# EAGLE design adc_cap (EAGLE 7.1.0)
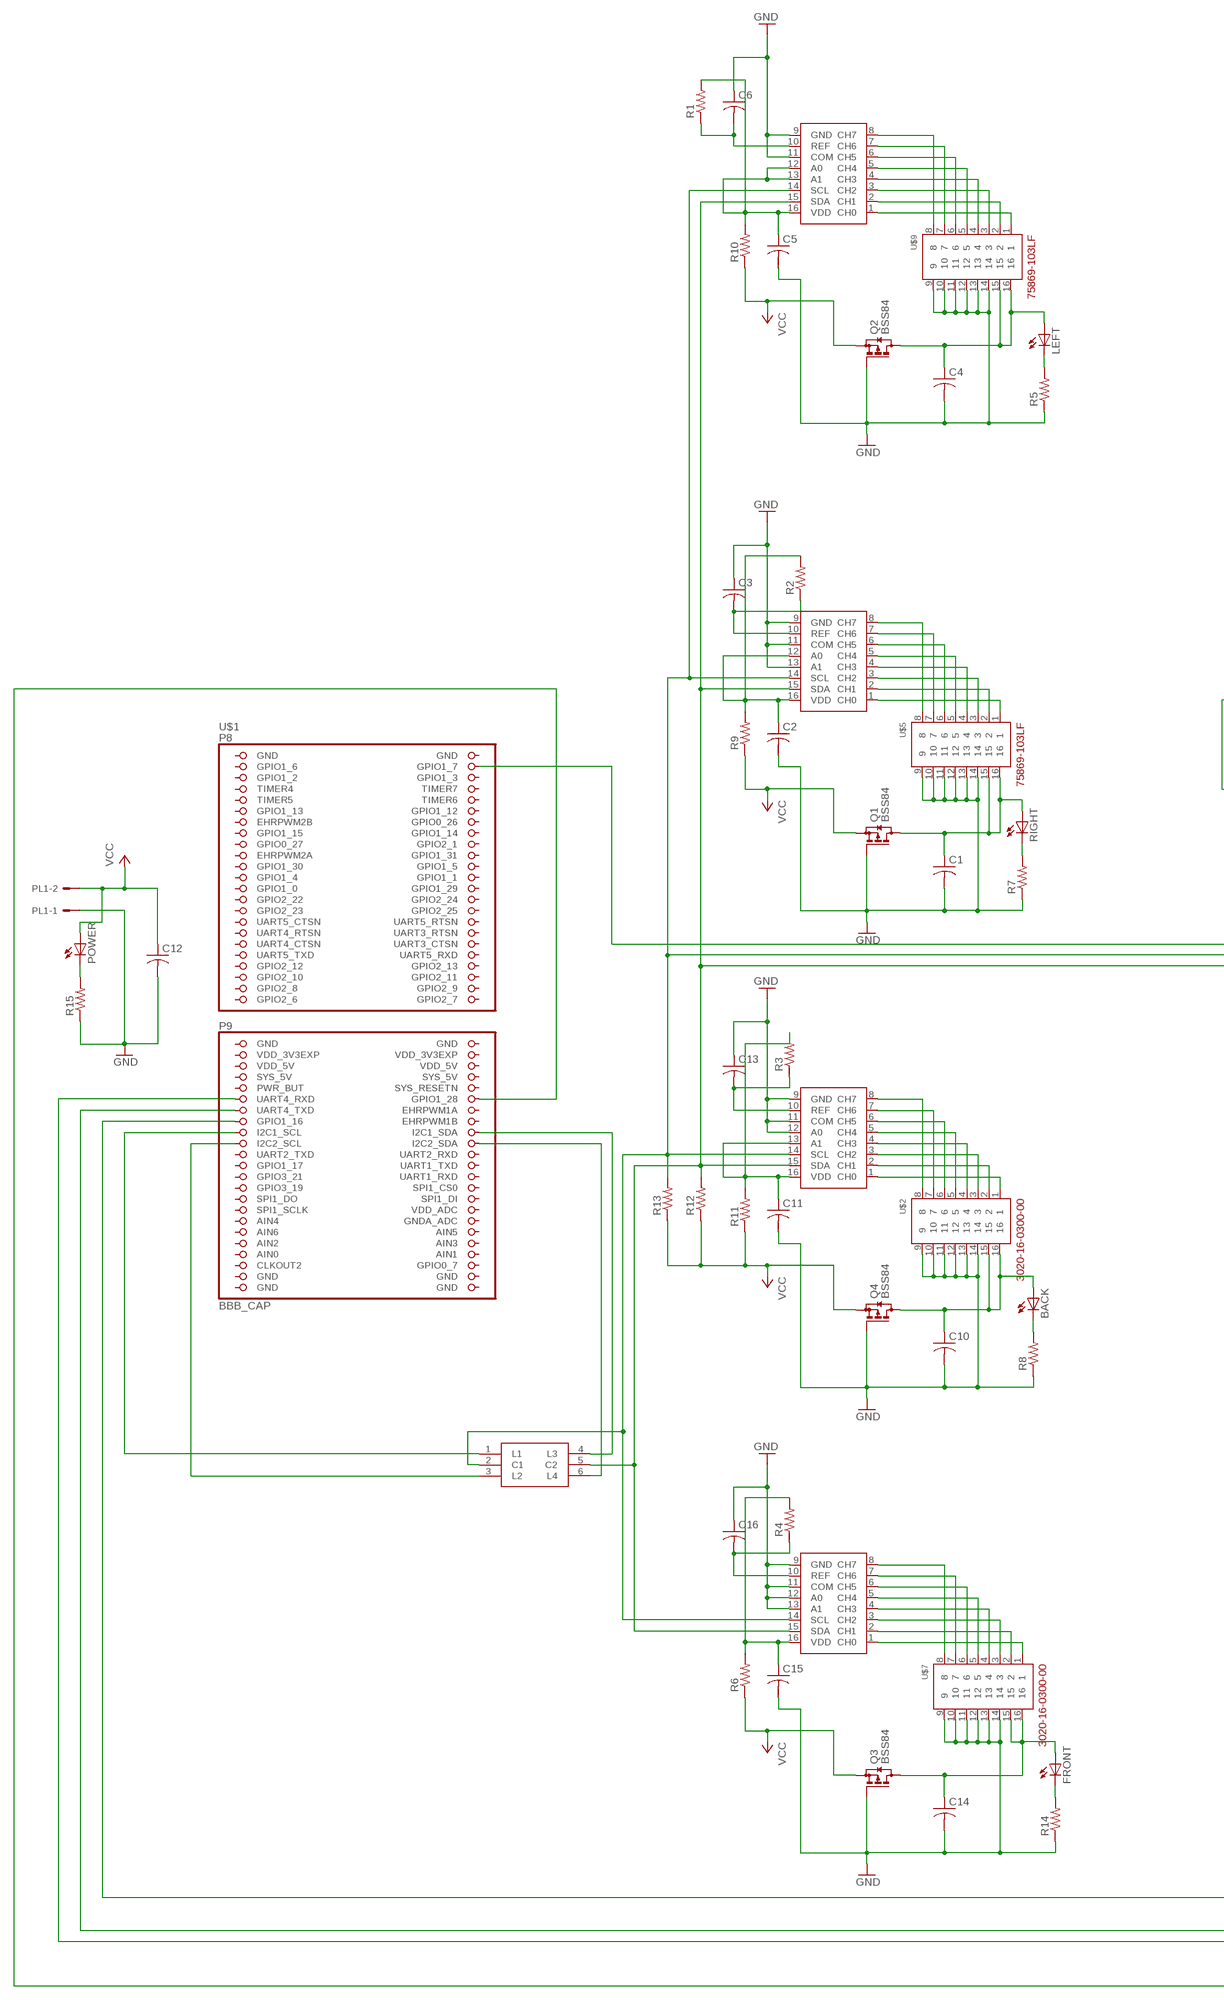
[diagram p0: schematic, sheet 1, part 1 of 2]
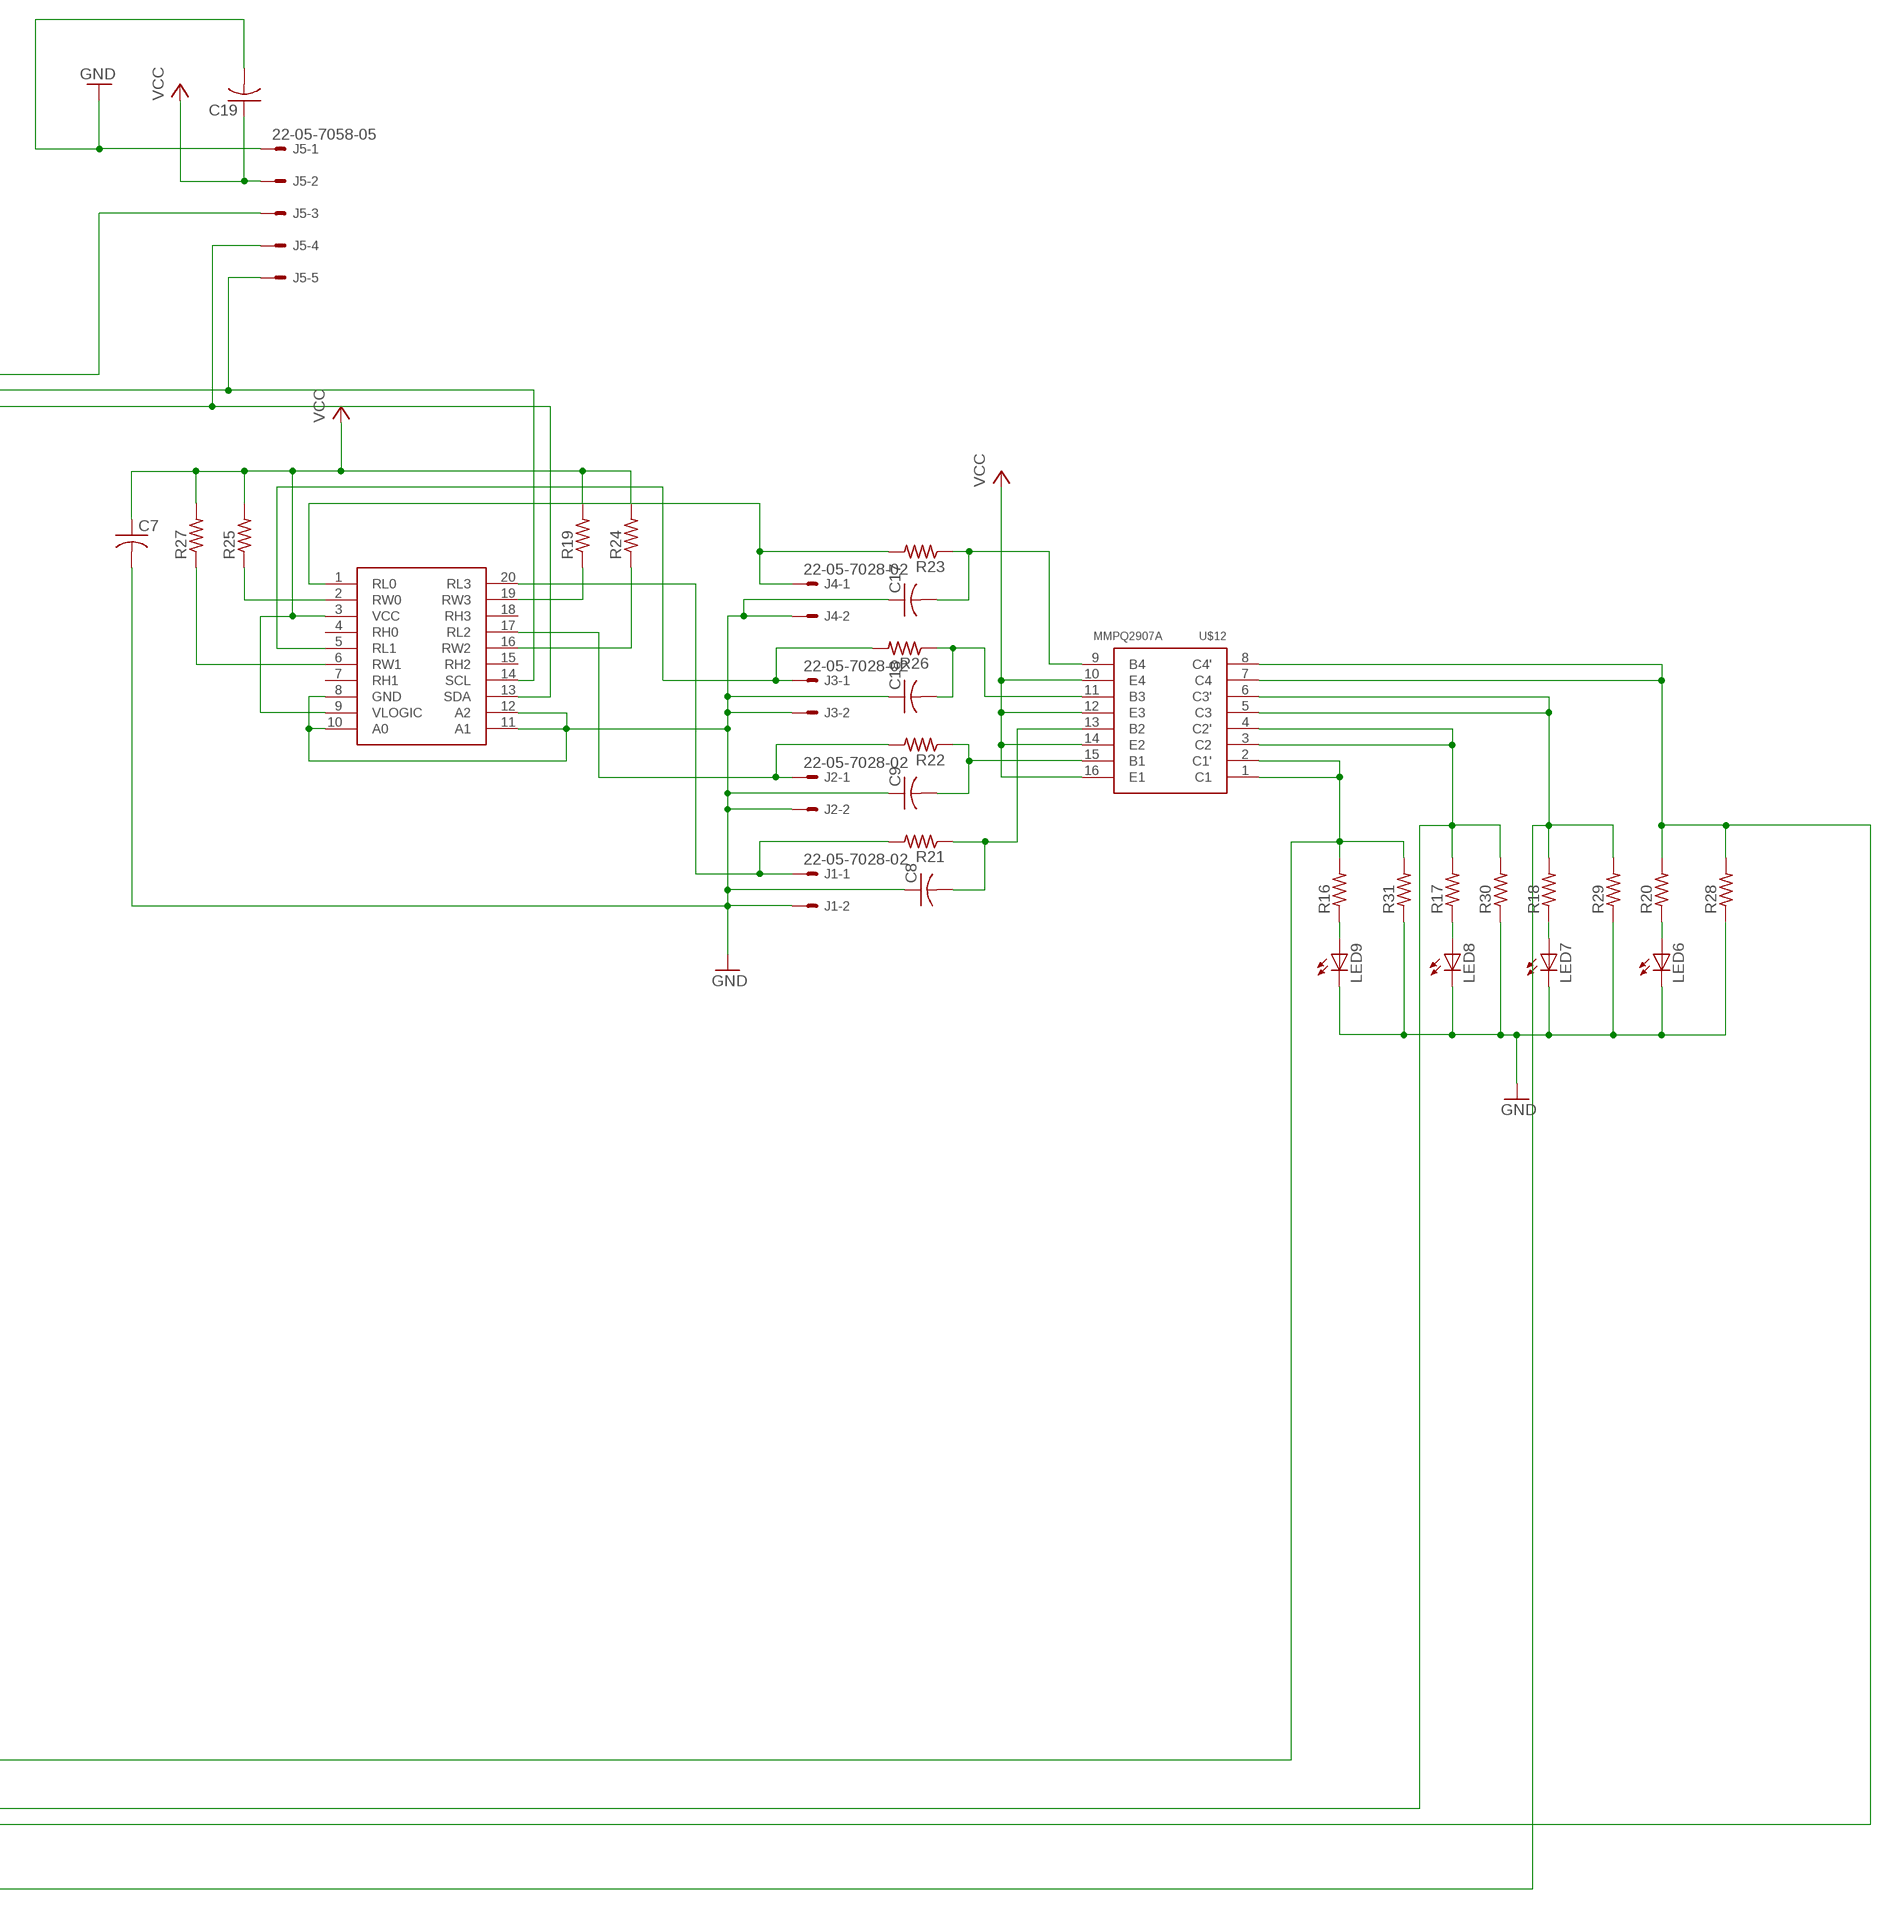
[diagram p1: schematic, sheet 1, part 2 of 2]

## Parts
BACK  LEDSML1206  [SML1206]
C1  C-USC1206K  [C1206K]
C2  C-USC1206K  [C1206K]
C3  C-USC1206K  [C1206K]
C4  C-USC1206K  [C1206K]
C5  C-USC1206K  [C1206K]
C6  C-USC1206K  [C1206K]
C7  C-USC1206K  [C1206K]
C8  C-USC1206K  [C1206K]
C9  C-USC1206K  [C1206K]
C10  C-USC1206K  [C1206K]
C11  C-USC1206K  [C1206K]
C12  C-USC0805  [C0805]
C13  C-USC1206K  [C1206K]
C14  C-USC1206K  [C1206K]
C15  C-USC1206K  [C1206K]
C16  C-USC1206K  [C1206K]
C17  C-USC1206K  [C1206K]
C18  C-USC1206K  [C1206K]
C19  C-USC1206K  [C1206K]
FRONT  LEDSML1206  [SML1206]
J1  22-05-7028-02  [7395-02]
J2  22-05-7028-02  [7395-02]
J3  22-05-7028-02  [7395-02]
J4  22-05-7028-02  [7395-02]
J5  22-05-7058-05  [7395-05]
LED6  LEDSML1206  [SML1206]
LED7  LEDSML1206  [SML1206]
LED8  LEDSML1206  [SML1206]
LED9  LEDSML1206  [SML1206]
LEFT  LEDSML1206  [SML1206]
PL1  555X-2H  [5569-2]
POWER  LEDSML1206  [SML1206]
Q1  BSS84  [SOT23]
Q2  BSS84  [SOT23]
Q3  BSS84  [SOT23]
Q4  BSS84  [SOT23]
R1  R-US_R1206W  [R1206W]
R2  R-US_R1206W  [R1206W]
R3  R-US_R1206W  [R1206W]
R4  R-US_R1206W  [R1206W]
R5  R-US_R1206W  [R1206W]
R6  R-US_R1206W  [R1206W]
R7  R-US_R1206W  [R1206W]
R8  R-US_R1206W  [R1206W]
R9  R-US_R1206W  [R1206W]
R10  R-US_R1206W  [R1206W]
R11  R-US_R1206W  [R1206W]
R12  R-US_R1206W  [R1206W]
R13  R-US_R1206W  [R1206W]
R14  R-US_R1206W  [R1206W]
R15  R-US_R1206W  [R1206W]
R16  R-US_R1206W  [R1206W]
R17  R-US_R1206W  [R1206W]
R18  R-US_R1206W  [R1206W]
R19  R-US_R1206W  [R1206W]
R20  R-US_R1206W  [R1206W]
R21  R-US_R1206W  [R1206W]
R22  R-US_R1206W  [R1206W]
R23  R-US_R1206W  [R1206W]
R24  R-US_R1206W  [R1206W]
R25  R-US_R1206W  [R1206W]
R26  R-US_R1206W  [R1206W]
R27  R-US_R1206W  [R1206W]
R28  R-US_R1206W  [R1206W]
R29  R-US_R1206W  [R1206W]
R30  R-US_R1206W  [R1206W]
R31  R-US_R1206W  [R1206W]
RIGHT  LEDSML1206  [SML1206]
U$1  BBB_CAP  [BBB]
U$2  3020-16-0300-00  [8X2_SMD_HEADER]
U$3  ADS7830  [ADC8_SD]
U$4  ADS7830  [ADC8_SD]
U$5  75869-103LF  [8X2_THROUGH_HOLE_HEADER]
U$6  ADS7830  [ADC8_SD]
U$7  3020-16-0300-00  [8X2_SMD_HEADER]
U$8  ADS7830  [ADC8_SD]
U$9  75869-103LF  [8X2_THROUGH_HOLE_HEADER]
U$10  CAS-220TB  [DPDT_DIP_SWITCH]
U$11  ISL23348_SD  [TSSOP-20]
U$12  MMPQ2907A  [SO1C-16]

## Nets
GND: C1.2 C2.2 C3.1 C4.2 C5.2 C6.1 C7.2 C8.1 C9.1 C10.2 C11.2 C12.2 C13.1 C14.2 C15.2 C16.1 C17.1 C18.1 C19.2 J1.2 J2.2 J3.2 J4.2 J5.1 LED6.C LED7.C LED8.C LED9.C PL1.1 Q1.1(G) Q2.1(G) Q3.1(G) Q4.1(G) R5.1 R7.1 R8.1 R14.1 R28.1 R29.1 R30.1 R31.1 U$2.9 U$2.10 U$2.11 U$2.12 U$2.13 U$2.14 U$3.9(GND) U$3.11(COM) U$3.12(A0) U$4.9(GND) U$4.11(COM) U$4.13(A1) U$5.9 U$5.10 U$5.11 U$5.12 U$5.13 U$5.14 U$6.9(GND) U$6.11(COM) U$7.9 U$7.10 U$7.11 U$7.12 U$7.13 U$7.14 U$8.9(GND) U$8.11(COM) U$8.12(A0) U$8.13(A1) U$9.9 U$9.10 U$9.11 U$9.12 U$9.13 U$9.14 U$11.8(GND) U$11.10(A0) U$11.11(A1) U$11.12(A2)
GND4: R15.1
N$1: U$2.1 U$3.1(CH0)
N$2: J5.4 R12.2 U$3.15(SDA) U$4.15(SDA) U$6.15(SDA) U$8.15(SDA) U$10.5(C2) U$11.13(SDA)
N$3: U$2.2 U$3.2(CH1)
N$4: U$2.3 U$3.3(CH2)
N$5: U$2.4 U$3.4(CH3)
N$6: U$2.5 U$3.5(CH4)
N$7: U$2.6 U$3.6(CH5)
N$8: U$2.7 U$3.7(CH6)
N$9: U$2.8 U$3.8(CH7)
N$10: U$1.P9_18(I2C1_SDA) U$10.4(L3)
N$11: U$1.P9_20(I2C2_SDA) U$10.6(L4)
N$12: C13.2 R3.1 U$3.10(REF)
N$13: J5.5 R13.2 U$3.14(SCL) U$4.14(SCL) U$6.14(SCL) U$8.14(SCL) U$10.2(C1) U$11.14(SCL)
N$14: R19.1 U$11.19(RW3)
N$15: U$4.1(CH0) U$5.1
N$16: U$4.2(CH1) U$5.2
N$17: U$4.3(CH2) U$5.3
N$18: U$4.4(CH3) U$5.4
N$19: U$4.5(CH4) U$5.5
N$20: U$4.6(CH5) U$5.6
N$21: U$4.7(CH6) U$5.7
N$22: U$4.8(CH7) U$5.8
N$23: U$1.P9_17(I2C1_SCL) U$10.1(L1)
N$24: U$1.P9_19(I2C2_SCL) U$10.3(L2)
N$25: C11.1 R3.2 R11.2 U$3.13(A1) U$3.16(VDD)
N$26: C3.2 R2.1 U$4.10(REF)
N$27: C4.1 LEFT.A Q2.3(D) U$9.15 U$9.16
N$28: U$6.1(CH0) U$9.1
N$29: U$6.2(CH1) U$9.2
N$30: U$6.3(CH2) U$9.3
N$31: U$6.4(CH3) U$9.4
N$32: U$6.5(CH4) U$9.5
N$33: U$6.6(CH5) U$9.6
N$34: U$6.7(CH6) U$9.7
N$35: U$6.8(CH7) U$9.8
N$36: R24.1 U$11.16(RW2)
N$37: U$7.1 U$8.1(CH0)
N$38: C2.1 R2.2 R9.2 U$4.12(A0) U$4.16(VDD)
N$39: C6.2 R1.1 U$6.10(REF)
N$40: R25.1 U$11.2(RW0)
N$41: U$7.2 U$8.2(CH1)
N$42: U$7.3 U$8.3(CH2)
N$43: U$7.4 U$8.4(CH3)
N$44: U$7.5 U$8.5(CH4)
N$45: U$7.6 U$8.6(CH5)
N$46: U$7.7 U$8.7(CH6)
N$47: U$7.8 U$8.8(CH7)
N$48: C5.1 R1.2 R10.2 U$6.12(A0) U$6.13(A1) U$6.16(VDD)
N$49: LEFT.C R5.2
N$50: R27.1 U$11.6(RW1)
N$51: C15.1 R4.2 R6.2 U$8.16(VDD)
N$52: C16.2 R4.1 U$8.10(REF)
N$53: C1.1 Q1.3(D) RIGHT.A U$5.15 U$5.16
N$54: R7.2 RIGHT.C
N$55: BACK.A C10.1 Q4.3(D) U$2.15 U$2.16
N$56: BACK.C R8.2
N$57: C14.1 FRONT.A Q3.3(D) U$7.15 U$7.16
N$58: FRONT.C R14.2
N$59: LED8.A R17.1
N$60: POWER.C R15.2
N$61: J4.1 R23.2 U$11.1(RL0)
N$62: J3.1 R26.2 U$11.5(RL1)
N$63: J2.1 R22.2 U$11.17(RL2)
N$64: J1.1 R21.2 U$11.20(RL3)
N$65: LED9.A R16.1
N$66: LED7.A R18.1
N$67: LED6.A R20.1
N$68: C17.2 R23.1 U$12.9(B4)
N$69: C18.2 R26.1 U$12.11(B3)
N$70: C9.2 R22.1 U$12.15(B1)
N$71: C8.2 R21.1 U$12.13(B2)
N$73: J5.3 U$1.P8_4(GPIO1_7)
N$77: R17.2 R30.2 U$1.P9_13(UART4_TXD) U$12.3(C2) U$12.4(C2')
N$78: R20.2 R28.2 U$1.P9_11(UART4_RXD) U$12.7(C4) U$12.8(C4')
N$79: R18.2 R29.2 U$1.P9_12(GPIO1_28) U$12.5(C3) U$12.6(C3')
N$80: R16.2 R31.2 U$1.P9_15(GPIO1_16) U$12.1(C1) U$12.2(C1')
VCC: C7.1 C12.1 C19.1 J5.2 PL1.2 POWER.A Q1.2(S) Q2.2(S) Q3.2(S) Q4.2(S) R6.1 R9.1 R10.1 R11.1 R12.1 R13.1 R19.2 R24.2 R25.2 R27.2 U$11.3(VCC) U$11.9(VLOGIC) U$12.10(E4) U$12.12(E3) U$12.14(E2) U$12.16(E1)
Unconnected: U$1.P8_3(GPIO1_6) U$1.P8_5(GPIO1_2) U$1.P8_6(GPIO1_3) U$1.P8_7(TIMER4) U$1.P8_8(TIMER7) U$1.P8_9(TIMER5) U$1.P8_10(TIMER6) U$1.P8_11(GPIO1_13) U$1.P8_12(GPIO1_12) U$1.P8_13(EHRPWM2B) U$1.P8_14(GPIO0_26) U$1.P8_15(GPIO1_15) U$1.P8_16(GPIO1_14) U$1.P8_17(GPIO0_27) U$1.P8_18(GPIO2_1) U$1.P8_19(EHRPWM2A) U$1.P8_20(GPIO1_31) U$1.P8_21(GPIO1_30) U$1.P8_22(GPIO1_5) U$1.P8_23(GPIO1_4) U$1.P8_24(GPIO1_1) U$1.P8_25(GPIO1_0) U$1.P8_26(GPIO1_29) U$1.P8_27(GPIO2_22) U$1.P8_28(GPIO2_24) U$1.P8_29(GPIO2_23) U$1.P8_30(GPIO2_25) U$1.P8_31(UART5_CTSN) U$1.P8_32(UART5_RTSN) U$1.P8_33(UART4_RTSN) U$1.P8_34(UART3_RTSN) U$1.P8_35(UART4_CTSN) U$1.P8_36(UART3_CTSN) U$1.P8_37(UART5_TXD) U$1.P8_38(UART5_RXD) U$1.P8_39(GPIO2_12) U$1.P8_40(GPIO2_13) U$1.P8_41(GPIO2_10) U$1.P8_42(GPIO2_11) U$1.P8_43(GPIO2_8) U$1.P8_44(GPIO2_9) U$1.P8_45(GPIO2_6) U$1.P8_46(GPIO2_7) U$1.P9_8(SYS_5V) U$1.P9_9(PWR_BUT) U$1.P9_10(SYS_RESETN) U$1.P9_14(EHRPWM1A) U$1.P9_16(EHRPWM1B) U$1.P9_21(UART2_TXD) U$1.P9_22(UART2_RXD) U$1.P9_23(GPIO1_17) U$1.P9_24(UART1_TXD) U$1.P9_25(GPIO3_21) U$1.P9_26(UART1_RXD) U$1.P9_27(GPIO3_19) U$1.P9_28(SPI1_CS0) U$1.P9_29(SPI1_DO) U$1.P9_30(SPI1_DI) U$1.P9_31(SPI1_SCLK) U$1.P9_32(VDD_ADC) U$1.P9_33(AIN4) U$1.P9_34(GNDA_ADC) U$1.P9_35(AIN6) U$1.P9_36(AIN5) U$1.P9_37(AIN2) U$1.P9_38(AIN3) U$1.P9_40(AIN1) U$1.P9_41(CLKOUT2) U$1.P9_42(GPIO0_7) U$11.4(RH0) U$11.7(RH1) U$11.15(RH2) U$11.18(RH3)

## Power pins joined to a net without a drawn wire
AIN0: U$1.P9_39(AIN0)
GND: U$1.P8_1(GND) U$1.P8_2(GND) U$1.P9_1(GND) U$1.P9_2(GND) U$1.P9_43(GND) U$1.P9_44(GND) U$1.P9_45(GND) U$1.P9_46(GND)
SYS_5V: U$1.P9_7(SYS_5V)
VDD_3V3EXP: U$1.P9_3(VDD_3V3EXP) U$1.P9_4(VDD_3V3EXP)
VDD_5V: U$1.P9_5(VDD_5V) U$1.P9_6(VDD_5V)

## Library data of the parts
BACK FRONT LED6-LED9 LEFT POWER RIGHT = led:LED: LED OSRAM: - CHIPLED LG R971, LG N971, LY N971, LG Q971, LY Q971, LO R971, LY R971 LH N974, LH R974 LS Q976, LO Q976, LY Q976 LO Q996 - Hyper CHIPLED LW Q18S LB Q993, LB Q99A, LB R99A - SideLED LS A670, LO A670, LY A670, LG A670, LP A670 LB A673, LV A673, LT A673, LW A673 LH A674 LY A675 LS A676, LA A676, LO A676, LY A676, LW A676 LS A679, LY A679, LG A679 - Hyper Micro SIDELED® LS Y876, LA Y876, LO Y876, LY Y876 LT Y87S - SmartLED LW L88C, LW L88S LB L89C, LB L89S, LG L890 LS L89K, LO L89K, LY L89K LS L896, LA L896, LO L896, LY L896 - TOPLED LS T670, LO T670, LY T670, LG T670, LP T670 LSG T670, LSP T670, LSY T670, LOP T670, LYG T670 LG T671, LOG T671, LSG T671 LB T673, LV T673, LT T673, LW T673 LH T674 LS T676, LA T676, LO T676, LY T676, LB T676, LH T676, LSB T676, LW T676 LB T67C, LV T67C, LT T67C, LS T67K, LO T67K, LY T67K, LW E67C LS E67B, LA E67B, LO E67B, LY E67B, LB E67C, LV E67C, LT E67C LW T67C LS T679, LY T679, LG T679 LS T770, LO T770, LY T770, LG T770, LP T770 LB T773, LV T773, LT T773, LW T773 LH T774 LS E675, LA E675, LY E675, LS T675 LS T776, LA T776, LO T776, LY T776, LB T776 LHGB T686 LT T68C, LB T68C - Hyper Mini TOPLED® LB M676 - Mini TOPLED Santana® LG M470 LS M47K, LO M47K, LY M47K Source: http://www.osram.convergy.de LUXEON: - LUMILED® LXK2-PW12-R00, LXK2-PW12-S00, LXK2-PW14-U00, LXK2-PW14-V00 LXK2-PM12-R00, LXK2-PM12-S00, LXK2-PM14-U00 LXK2-PE12-Q00, LXK2-PE12-R00, LXK2-PE12-S00, LXK2-PE14-T00, LXK2-PE14-U00 LXK2-PB12-K00, LXK2-PB12-L00, LXK2-PB12-M00, LXK2-PB14-N00, LXK2-PB14-P00, LXK2-PB14-Q00 LXK2-PR12-L00, LXK2-PR12-M00, LXK2-PR14-Q00, LXK2-PR14-R00 LXK2-PD12-Q00, LXK2-PD12-R00, LXK2-PD12-S00 LXK2-PH12-R00, LXK2-PH12-S00 LXK2-PL12-P00, LXK2-PL12-Q00, LXK2-PL12-R00 Source: www.luxeon.com KINGBRIGHT: KA-3528ASYC Source: www.kingbright.com
C1-C19 = rcl:C-US: CAPACITOR, American symbol
J1-J4 = con-molex:22-?-02: CONNECTOR wire to board 2.54 mm (.1 inch) pitch header; OC_FARNELL: 9731601; OC_NEWARK: unknown
J5 = con-molex:22-?-05: CONNECTOR wire to board 2.54 mm (.1 inch) pitch header; OC_FARNELL: unknown; OC_NEWARK: unknown
PL1 = con-molex-2:555X-2: Mini FIT connector 2 way
Q1-Q4 = transistor-small-signal:BSS84: P-CHANNEL MOS FET
R1-R31 = rcl:R-US_: RESISTOR, American symbol
U$1 = TIparts:BBB_CAP
U$2 U$7 = TIparts:3020-16-0300-00
U$3 U$4 U$6 U$8 = ADC128D818:ADS7830
U$5 U$9 = TIparts:75869-103LF
U$10 = TIparts:CAS-220TB
U$11 = TIparts:ISL23348_SD
U$12 = TIparts:MMPQ2907A

## Net classes
0 default: width 0.203 mm, drill 0.381 mm, clearance 0.254 mm

## Board
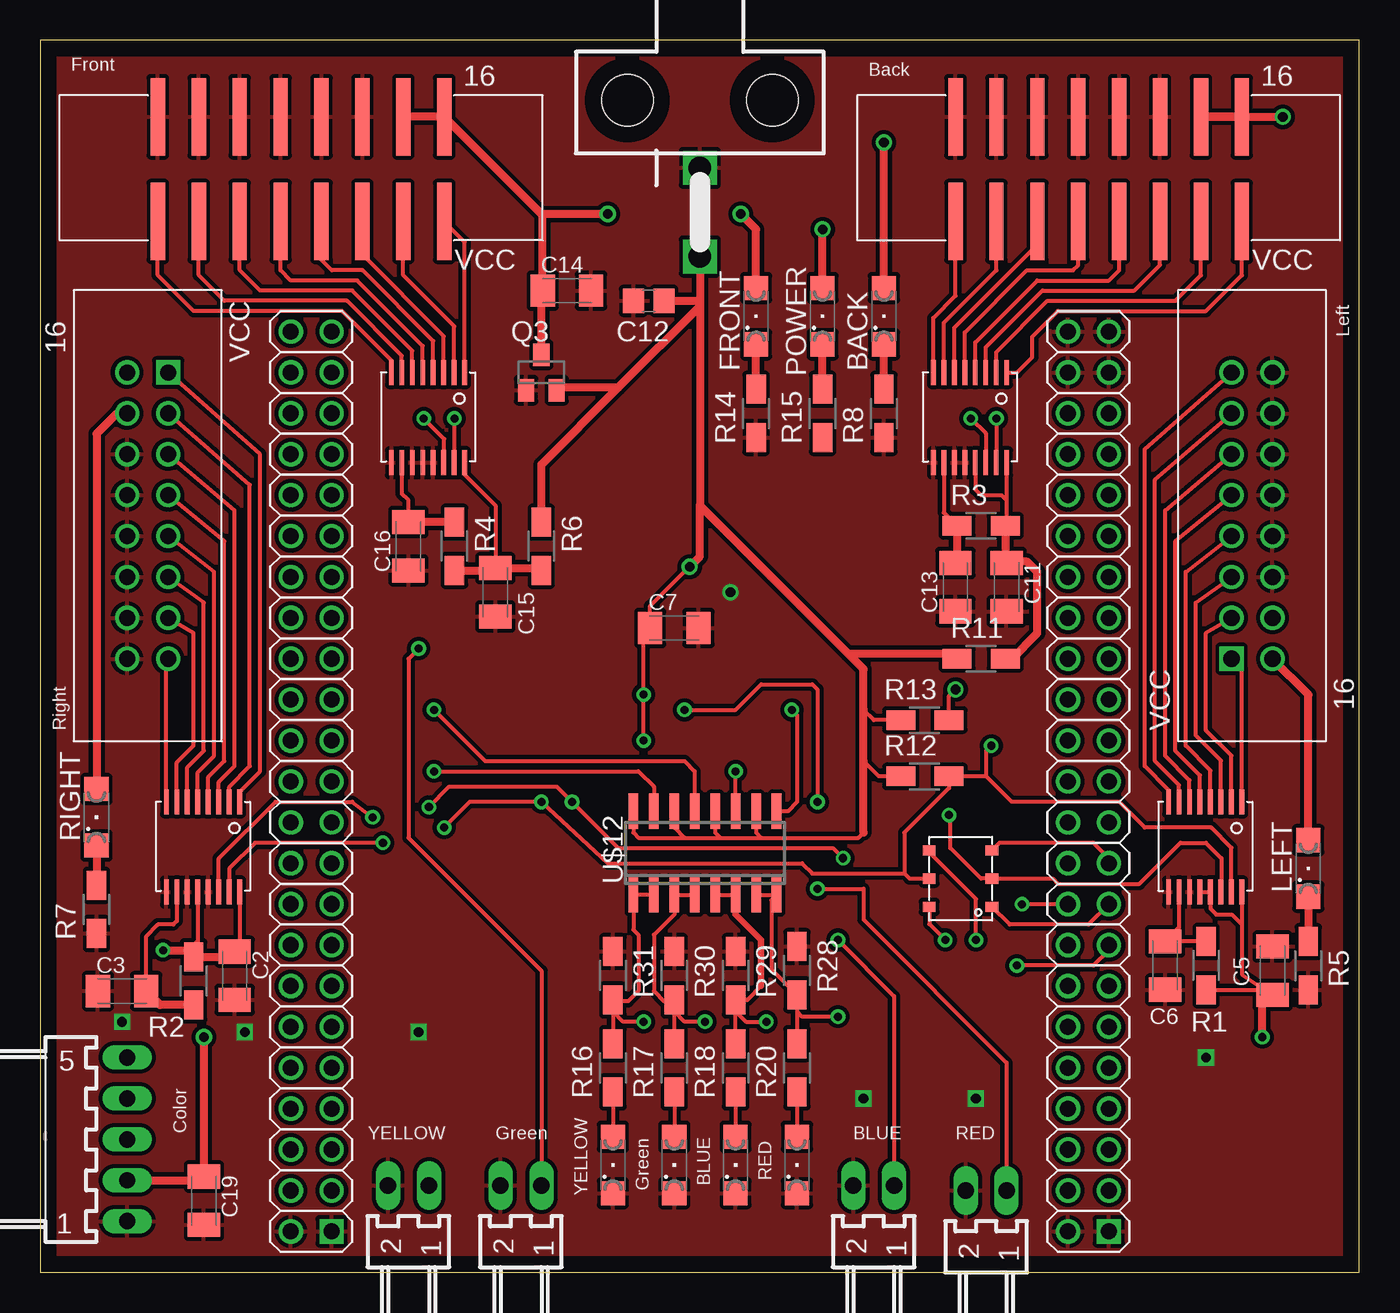
[diagram p2: board, top side]
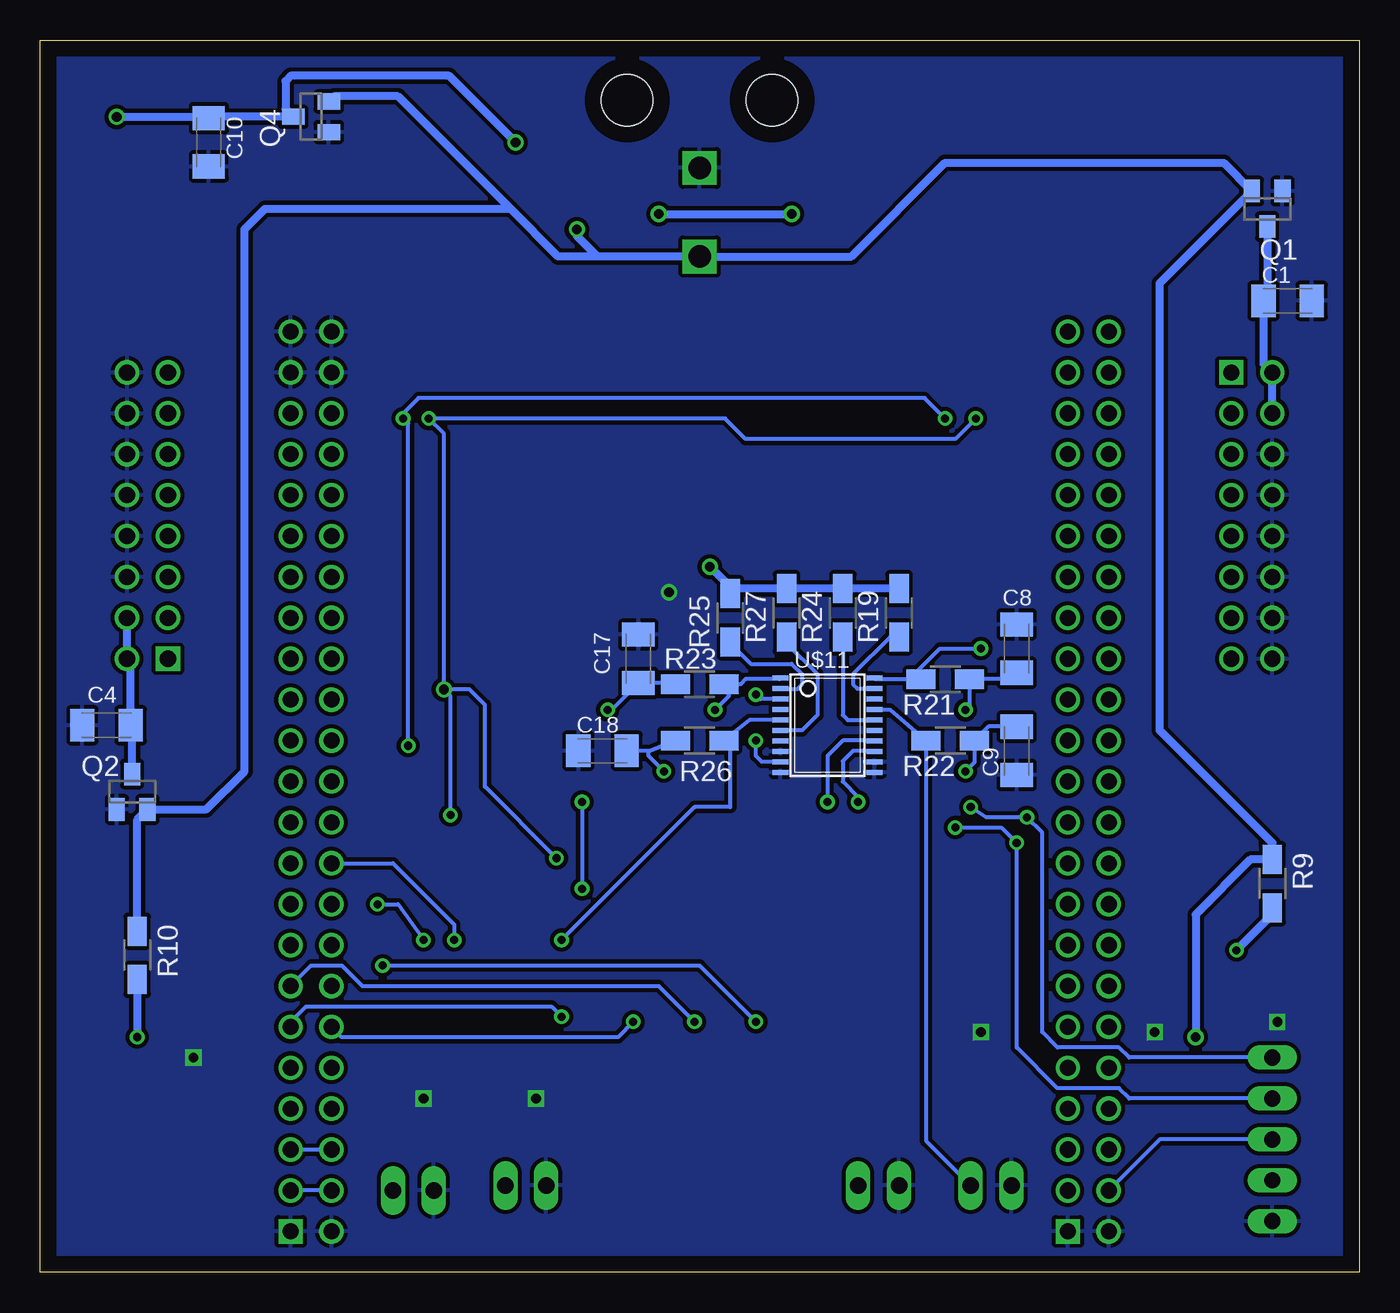
[diagram p3: board, bottom side, seen from below]

Size 81.9 x 76.51 mm. Coordinates in mm from the lower left corner, seen from the top.
Outline: 0,0 81.9,0 81.9,76.51 0,76.51 0,0
Copper layers (1*16): Top 0.035mm / dielectric 1.5mm / Bottom 0.035mm
Design rules "default *": minimum track width 10mil, minimum drill 19mil, track to track 8mil, track to pad 8mil, pad to pad 8mil, via to via 8mil, smd to smd 8mil, copper to edge 40mil, drill to drill 8mil, minimum pad ring 10mil, minimum via ring 8mil, stop-mask expansion 4mil, vias tented up to drill 0mil, thermal gap 10mil

### Footprints (pad centres in the part's own frame; a part is rotated, then mirrored left to right if it is on the bottom)
SML1206 = smd 1.5 x 1.5: A 1.75,0; C -1.75,0
C1206K = smd 1.5 x 2: 1 -1.5,0; 2 1.5,0
C0805 = smd 1.3 x 1.5: 1 -0.95,0; 2 0.95,0
7395-02 = drill 1.016 long: 1 1.27,0; 2 -1.27,0
7395-05 = drill 1.016 long: 1 5.08,0; 2 2.54,0; 3 0,0; 4 -2.54,0; 5 -5.08,0
5569-2 = drill 1.4 square: 1 0,0; 2 0,5.5 | hole 3.2: 4.5,-4.2; -4.5,-4.2
SOT23 = smd 1 x 1.4: 1 -0.95,-1.1; 2 0.95,-1.1; 3 0,1.1
R1206W = smd 1.8 x 1.2: 1 -1.499,0; 2 1.499,0
BBB = drill 1 square: P8_1 -22.225,-29.21; P9_1 26.035,-29.21 | drill 1: P8_2 -24.765,-29.21; P8_3 -22.225,-26.67; P8_4 -24.765,-26.67; P8_5 -22.225,-24.13; P8_6 -24.765,-24.13; P8_7 -22.225,-21.59; P8_8 -24.765,-21.59; P8_9 -22.225,-19.05; P8_10 -24.765,-19.05; P8_11 -22.225,-16.51; P8_12 -24.765,-16.51; P8_13 -22.225,-13.97; P8_14 -24.765,-13.97; P8_15 -22.225,-11.43; P8_16 -24.765,-11.43; P8_17 -22.225,-8.89; P8_18 -24.765,-8.89; P8_19 -22.225,-6.35; P8_20 -24.765,-6.35; P8_21 -22.225,-3.81; P8_22 -24.765,-3.81; P8_23 -22.225,-1.27; P8_24 -24.765,-1.27; P8_25 -22.225,1.27; P8_26 -24.765,1.27; P8_27 -22.225,3.81; P8_28 -24.765,3.81; P8_29 -22.225,6.35; P8_30 -24.765,6.35; P8_31 -22.225,8.89; P8_32 -24.765,8.89; P8_33 -22.225,11.43; P8_34 -24.765,11.43; P8_35 -22.225,13.97; P8_36 -24.765,13.97; P8_37 -22.225,16.51; P8_38 -24.765,16.51; P8_39 -22.225,19.05; P8_40 -24.765,19.05; P8_41 -22.225,21.59; P8_42 -24.765,21.59; P8_43 -22.225,24.13; P8_44 -24.765,24.13; P8_45 -22.225,26.67; P8_46 -24.765,26.67; P9_2 23.495,-29.21; P9_3 26.035,-26.67; P9_4 23.495,-26.67; P9_5 26.035,-24.13; P9_6 23.495,-24.13; P9_7 26.035,-21.59; P9_8 23.495,-21.59; P9_9 26.035,-19.05; P9_10 23.495,-19.05; P9_11 26.035,-16.51; P9_12 23.495,-16.51; P9_13 26.035,-13.97; P9_14 23.495,-13.97; P9_15 26.035,-11.43; P9_16 23.495,-11.43; P9_17 26.035,-8.89; P9_18 23.495,-8.89; P9_19 26.035,-6.35; P9_20 23.495,-6.35; P9_21 26.035,-3.81; P9_22 23.495,-3.81; P9_23 26.035,-1.27; P9_24 23.495,-1.27; P9_25 26.035,1.27; P9_26 23.495,1.27; P9_27 26.035,3.81; P9_28 23.495,3.81; P9_29 26.035,6.35; P9_30 23.495,6.35; P9_31 26.035,8.89; P9_32 23.495,8.89; P9_33 26.035,11.43; P9_34 23.495,11.43; P9_35 26.035,13.97; P9_36 23.495,13.97; P9_37 26.035,16.51; P9_38 23.495,16.51; P9_39 26.035,19.05; P9_40 23.495,19.05; P9_41 26.035,21.59; P9_42 23.495,21.59; P9_43 26.035,24.13; P9_44 23.495,24.13; P9_45 26.035,26.67; P9_46 23.495,26.67
8X2_SMD_HEADER = smd 0.89 x 4.8: 1 -8.89,3.325; 2 -6.35,3.325; 3 -3.81,3.325; 4 -1.27,3.325; 5 1.27,3.325; 6 3.81,3.325; 7 6.35,3.325; 8 8.89,3.325; 9 8.89,-3.175; 10 6.35,-3.175; 11 3.81,-3.175; 12 1.27,-3.175; 13 -1.27,-3.175; 14 -3.81,-3.175; 15 -6.35,-3.175; 16 -8.89,-3.175
ADC8_SD = smd 0.3 x 1.55: 1 0,0; 2 0.65,0; 3 1.3,0; 4 1.95,0; 5 2.6,0; 6 3.25,0; 7 3.9,0; 8 4.55,0; 9 4.55,5.6; 10 3.9,5.6; 11 3.25,5.6; 12 2.6,5.6; 13 1.95,5.6; 14 1.3,5.6; 15 0.65,5.6; 16 0,5.6
8X2_THROUGH_HOLE_HEADER = drill 1 square: 1 -8.89,1.27 | drill 1: 2 -6.35,1.27; 3 -3.81,1.27; 4 -1.27,1.27; 5 1.27,1.27; 6 3.81,1.27; 7 6.35,1.27; 8 8.89,1.27; 9 8.89,-1.27; 10 6.35,-1.27; 11 3.81,-1.27; 12 1.27,-1.27; 13 -1.27,-1.27; 14 -3.81,-1.27; 15 -6.35,-1.27; 16 -8.89,-1.27
DPDT_DIP_SWITCH = smd 0.635 x 0.8: 1 -1.75,-1.95; 2 0,-1.95; 3 1.75,-1.95; 4 1.75,1.95; 5 0,1.95; 6 -1.75,1.95
TSSOP-20 = smd 0.305 x 0.991: 1 -2.925,-2.918; 2 -2.275,-2.918; 3 -1.625,-2.918; 4 -0.975,-2.918; 5 -0.325,-2.918; 6 0.325,-2.918; 7 0.975,-2.918; 8 1.625,-2.918; 9 2.275,-2.918; 10 2.925,-2.918; 11 2.925,2.918; 12 2.275,2.918; 13 1.625,2.918; 14 0.975,2.918; 15 0.325,2.918; 16 -0.325,2.918; 17 -0.975,2.918; 18 -1.625,2.918; 19 -2.275,2.918; 20 -2.925,2.918
SO1C-16 = smd 0.6 x 2.2: 1 -4.445,-2.6; 2 -3.175,-2.6; 3 -1.905,-2.6; 4 -0.635,-2.6; 5 0.635,-2.6; 6 1.905,-2.6; 7 3.175,-2.6; 8 4.445,-2.6; 9 4.445,2.6; 10 3.175,2.6; 11 1.905,2.6; 12 0.635,2.6; 13 -0.635,2.6; 14 -1.905,2.6; 15 -3.175,2.6; 16 -4.445,2.6

### Placement (x,y rotation side)
BACK  52.39,59.37 90 top
C1  4.45,60.33 0 bottom
C2  12.07,18.41 270 top
C3  5.08,17.46 0 top
C4  77.79,33.97 180 bottom
C5  76.52,18.73 90 top
C6  69.85,19.05 90 top
C7  39.37,40.01 0 top
C8  21.27,38.74 270 bottom
C9  21.27,32.38 90 bottom
C10  71.44,70.17 270 bottom
C11  60.01,42.55 270 top
C12  37.78,60.33 180 top
C13  56.83,42.55 90 top
C14  32.7,60.96 0 top
C15  28.26,42.23 270 top
C16  22.86,45.09 90 top
C17  44.77,38.1 270 bottom
C18  46.99,32.38 0 bottom
C19  10.16,4.45 270 top
FRONT  44.45,59.37 90 top
J1  29.84,5.4 0 top
J2  22.86,5.4 0 top
J3  51.75,5.4 0 top
J4  58.74,5.08 0 top
J5  5.4,8.26 270 top
LED6  46.99,6.67 90 top
LED7  43.18,6.67 90 top
LED8  39.37,6.67 90 top
LED9  35.56,6.67 90 top
LEFT  78.74,25.08 90 top
PL1  40.96,68.58 180 top
POWER  48.58,59.37 90 top
Q1  5.71,66.04 180 bottom
Q2  76.2,29.84 0 bottom
Q3  31.12,55.88 0 top
Q4  65.09,71.75 90 bottom
R1  72.39,19.05 270 top
R2  9.53,18.1 90 top
R3  58.42,46.36 0 top
R4  25.72,45.09 270 top
R5  78.74,19.05 90 top
R6  31.12,45.09 270 top
R7  3.49,22.54 90 top
R8  52.39,53.34 90 top
R9  5.4,24.13 270 bottom
R10  75.88,19.68 270 bottom
R11  58.42,38.1 0 top
R12  54.93,30.8 0 top
R13  54.93,34.29 0 top
R14  44.45,53.34 90 top
R15  48.58,53.34 90 top
R16  35.56,12.7 90 top
R17  39.37,12.7 90 top
R18  43.18,12.7 90 top
R19  28.57,40.96 90 bottom
R20  46.99,12.7 90 top
R21  25.72,36.83 180 bottom
R22  25.4,33.02 180 bottom
R23  40.96,36.51 0 bottom
R24  32.07,40.96 90 bottom
R25  39.05,40.64 90 bottom
R26  40.96,33.02 0 bottom
R27  35.56,40.96 90 bottom
R28  46.99,18.73 270 top
R29  43.18,18.41 270 top
R30  39.37,18.41 270 top
R31  35.56,18.41 270 top
RIGHT  3.49,28.26 90 top
U$1  40.32,31.75 0 top
U$2  65.72,68.58 180 top
U$3  60.01,55.88 180 top
U$4  12.38,29.21 180 top
U$5  6.67,46.99 270 top
U$6  74.61,29.21 180 top
U$7  16.19,68.58 180 top
U$8  26.35,55.88 180 top
U$9  75.25,46.99 90 top
U$10  57.15,24.45 90 top
U$11  33.02,33.97 270 bottom
U$12  41.27,26.04 0 top

### Tracks (layer width: path | path; a pad name or v marks a point on that pad's centre or on a via)
GND  (via drill 0.6)
  other vias: 42.86,42.23 5.08,15.56 12.7,14.92 23.5,14.92 51.12,10.79 58.1,10.79 72.39,13.33
  pour Top: 0,76.52 81.92,76.52 81.92,0 0,0
  pour Bottom: 0,76.52 81.92,76.52 81.92,0 0,0
N$1
  Top 0.254: U$3.1 60.64,55.88 61.59,56.83 61.59,58.1 63.18,59.69 72.39,59.69 74.61,61.91 U$2.1
N$2  (via drill 0.5)
  Top 0.254: 53.66,24.77 53.66,27.3 56.43,30.07 R12.2 58.74,30.8 | 53.66,24.77 53.98,24.45 U$10.5 | U$6.15 73.96,26.37 72.71,27.62 68.58,27.62 66.99,29.21 60.33,29.21 58.74,30.8 | 58.74,30.8 58.74,32.38 v59.05,32.7 | v59.37,53.02 59.37,50.3 U$3.15 | U$8.15 25.72,50.3 v25.72,53.02 | 53.66,24.77 47.94,24.77 47.31,25.4 35.24,25.4 v31.12,29.21 26.67,29.21 v25.08,27.62 | v21.27,26.67 13.34,26.67 11.73,25.07 U$4.15
  Bottom 0.254: v59.05,32.7 59.05,52.71 v59.37,53.02 59.37,53.34 58.42,54.29 26.99,54.29 v25.72,53.02 | U$11.13 30.14,32.38 31.43,32.38 32.07,31.75 32.07,30.48 31.12,29.53 v31.12,29.21 | v25.08,27.62 22.23,27.62 v21.27,26.67 21.27,13.97 18.73,11.43 14.92,11.43 14.29,10.79 J5.4
N$3
  Top 0.254: U$3.2 59.36,57.14 62.55,60.33 70.48,60.33 72.07,61.91 U$2.2
N$4
  Top 0.254: U$3.3 58.71,57.44 62.23,60.96 67.95,60.96 69.53,62.55 U$2.3
N$5
  Top 0.254: U$3.4 58.06,57.74 61.91,61.6 66.36,61.6 66.99,62.23 U$2.4
N$6
  Top 0.254: U$3.5 57.41,58.36 61.28,62.23 64.13,62.23 64.45,62.55 U$2.5
N$7
  Top 0.254: U$3.6 56.76,58.66 61.91,63.82 U$2.6
N$8
  Top 0.254: U$3.7 56.11,58.97 59.37,62.23 U$2.7
N$9
  Top 0.254: U$3.8 55.46,59.27 56.83,60.64 U$2.8
N$10  (via drill 0.5)
  Top 0.254: U$1.P9_18 v60.96,22.86 | v58.1,20.64 58.1,23.18 55.2,26.08 U$10.4
  Bottom 0.254: v60.96,22.86 59.69,22.86 v58.1,20.64
N$11  (via drill 0.5)
  Top 0.254: U$10.6 55.2,21.63 v56.2,20.64
  Bottom 0.254: U$1.P9_20 60.01,25.4 56.2,21.59 v56.2,20.64
N$12
  Top 0.254: U$3.10 56.11,47.17 R3.1
  Top 0.508: R3.1 56.92,44.13 C13.2
N$13  (via drill 0.5, 0.6)
  Top 0.254: U$6.14 73.34,23.64 73.34,25.72 72.39,26.67 70.8,26.67 68.26,24.13 63.18,24.13 62.87,24.45 U$10.2 58.42,24.45 56.51,26.35 56.51,28.3 v56.43,28.39 | R13.2 56.43,35.79 v56.83,36.2 | v57.79,53.02 58.71,52.1 U$3.14 | U$8.14 25.08,50.31 25.08,51.75 v23.81,53.02 | v49.85,25.72 49.21,26.35 35.88,26.35 v33.02,29.21 32.07,30.16 25.4,30.16 v24.13,28.89 | U$4.14 11.08,25.69 14.6,29.21 19.37,29.21 v20.64,28.26
  Bottom 0.254: v56.83,36.2 56.83,52.07 v57.79,53.02 39.37,53.02 38.1,51.75 25.08,51.75 v23.81,53.02 | U$11.14 30.12,33.02 32.07,33.02 33.02,32.07 v33.02,29.21 | v49.85,25.72 54.29,30.16 54.29,35.24 55.24,36.2 v56.83,36.2 | v24.13,28.89 23.18,28.26 v20.64,28.26 19.69,27.3 19.69,14.92 18.73,13.97 14.92,13.97 14.29,13.33 J5.5 | v56.43,28.39 56.43,35.79 v56.83,36.2
N$14
  Bottom 0.254: R19.1 29.12,39.46 31.43,37.15 31.43,36.51 31.17,36.25 U$11.19
N$15
  Top 0.254: U$4.1 12.38,29.84 13.65,31.11 13.65,50.8 U$5.1
N$16
  Top 0.254: U$4.2 11.73,30.15 13.02,31.43 13.02,48.9 U$5.2
N$17
  Top 0.254: U$4.3 11.08,30.45 12.07,31.43 12.07,47.31 U$5.3
N$18
  Top 0.254: U$4.4 10.43,30.75 11.43,31.75 11.43,45.4 U$5.4
N$19
  Top 0.254: U$4.5 9.78,31.05 10.79,32.07 10.79,43.5 U$5.5
N$20
  Top 0.254: U$4.6 9.13,31.36 10.16,32.38 10.16,41.59 U$5.6
N$21
  Top 0.254: U$4.7 8.48,31.66 9.52,32.7 9.52,39.69 U$5.7
N$22
  Top 0.254: U$4.8 7.83,38 U$5.8
N$23
  Top 0.254: U$1.P9_17 65.09,21.59 60.21,21.59 U$10.1
N$24
  Top 0.254: U$1.P9_19 66.36,25.72 65.41,26.67 59.57,26.67 U$10.3
N$25
  Top 0.254: U$3.16 60.01,47.94 | 60.01,47.94 60.01,46.44 R3.2 | U$3.13 58.06,48.62 58.42,48.26 59.69,48.26 60.01,47.94
  Top 0.508: R3.2 59.92,44.13 C11.1 60.09,44.13 61.28,44.13 61.91,43.5 61.91,39.69 60.33,38.1 R11.2
N$26
  Top 0.254: C3.2 6.58,20.87 7.3,21.59 8.26,21.59 8.48,21.82 U$4.10
  Top 0.508: R2.1 7.44,16.6 C3.2
N$27
  Top 0.508: LEFT.A 78.74,35.88 U$9.16
  Bottom 0.508: Q2.3 76.2,33.89 C4.1 76.29,37.87 U$9.16 U$9.15
N$28
  Top 0.254: U$6.1 74.61,37.47 U$9.1
N$29
  Top 0.254: U$6.2 73.96,32.08 72.39,33.66 72.39,39.69 U$9.2
N$30
  Top 0.254: U$6.3 73.31,31.78 71.75,33.34 71.75,41.59 U$9.3
N$31
  Top 0.254: U$6.4 72.66,31.16 71.12,32.7 71.12,43.5 U$9.4
N$32
  Top 0.254: U$6.5 72.01,30.86 70.48,32.38 70.48,45.4 U$9.5
N$33
  Top 0.254: U$6.6 71.36,30.55 69.85,32.07 69.85,47.31 U$9.6
N$34
  Top 0.254: U$6.7 70.71,30.25 69.22,31.75 69.22,49.21 U$9.7
N$35
  Top 0.254: U$6.8 70.06,29.95 68.58,31.43 68.58,51.12 U$9.8
N$36
  Bottom 0.254: R24.1 32.07,34.61 31.75,34.29 U$11.16
N$37
  Top 0.254: U$8.1 26.35,63.99 U$7.1
N$38  (via drill 0.5)
  Top 0.254: U$4.12 9.78,20.58 9.16,19.96 | U$4.16 12.38,20.23 C2.1
  Top 0.508: v7.62,20 9.12,20 9.16,19.96 R2.2 11.75,19.6 C2.1
  Bottom 0.508: R9.2 5.4,22.22 v7.62,20
N$39
  Top 0.254: R1.1 C6.2 70.71,21.41 U$6.10
N$40
  Bottom 0.254: R25.1 39.05,39.05 37.78,37.78 35.24,37.78 34.61,37.15 34.61,36.51 34.92,36.2 35.89,36.2 U$11.2
N$41
  Top 0.254: U$8.2 25.7,58.75 22.54,61.91 U$7.2
N$42
  Top 0.254: U$8.3 25.05,58.13 20,63.18 U$7.3
N$43
  Top 0.254: U$8.4 24.4,57.83 20,62.23 18.1,62.23 17.46,62.87 U$7.4
N$44
  Top 0.254: U$8.5 23.75,57.53 19.69,61.6 15.56,61.6 14.92,62.23 U$7.5
N$45
  Top 0.254: U$8.6 23.1,57.23 19.37,60.96 13.65,60.96 12.38,62.23 U$7.6
N$46
  Top 0.254: U$8.7 22.45,56.92 19.05,60.33 11.43,60.33 9.84,61.91 U$7.7
N$47
  Top 0.254: U$8.8 21.8,56.62 18.73,59.69 9.52,59.69 7.3,61.91 U$7.8
N$48  (via drill 0.5)
  Top 0.254: U$6.16 74.61,21.59 | 74.61,21.59 74.61,18.5 C5.1 75.56,17.55 R1.2 | U$6.12 U$6.13 72.66,22.59 73.03,22.22 73.98,22.22 74.61,21.59
  Top 0.508: v75.88,14.61 75.88,16.6 C5.1
  Bottom 0.508: R10.2 v75.88,14.61
N$49
  Top 0.508: LEFT.C R5.2
N$50
  Bottom 0.254: R27.1 35.56,39.05 33.66,37.15 33.66,34.61 34.61,33.66 35.93,33.66 U$11.6
N$51
  Top 0.254: U$8.16 26.35,49.53 28.26,47.62 C15.1
  Top 0.508: R4.2 28.12,43.59 C15.1 30.97,43.73 R6.2
N$52
  Top 0.254: C16.2 22.86,47.94 22.45,48.35 U$8.10
  Top 0.508: R4.1 C16.2
N$53
  Top 0.508: U$5.15 4.76,53.34 3.49,52.07 RIGHT.A
  Bottom 0.508: Q1.3 5.72,60.55 C1.1 5.94,56.43 U$5.16 U$5.15
N$54
  Top 0.508: RIGHT.C R7.2
N$55  (via drill 0.6)
  Top 0.508: BACK.A v52.39,70.17 | U$2.16 U$2.15 v77.15,71.75
  Bottom 0.508: v52.39,70.17 56.51,74.3 66.36,74.3 66.67,73.98 66.67,72.24 Q4.3 71.35,71.75 C10.1 71.53,71.75 v77.15,71.75
N$56
  Top 0.508: R8.2 BACK.C
N$57  (via drill 0.6)
  Top 0.508: Q3.3 31.12,60.87 C14.1 31.2,65.63 31.12,65.72 | 31.12,65.72 U$7.16 U$7.15 | FRONT.A 44.45,64.77 v43.5,65.72 | v35.24,65.72 31.12,65.72
  Bottom 0.508: v43.5,65.72 v35.24,65.72
N$58
  Top 0.508: R14.2 FRONT.C
N$59
  Top 0.254: R17.1 LED8.A
N$60
  Top 0.508: R15.2 POWER.C
N$61  (via drill 0.5)
  Top 0.254: v40.01,34.93 43.18,34.93 44.77,36.51 47.94,36.51 48.26,36.2 v48.26,29.21 | v48.26,23.81 51.12,23.81 51.12,21.91 60.01,13.02 J4.1
  Bottom 0.254: U$11.1 36.01,36.83 38.1,36.83 38.42,36.51 R23.2 39.14,35.79 v40.01,34.93 | v48.26,29.21 v48.26,23.81
N$62  (via drill 0.5)
  Top 0.254: v49.53,20.64 53.02,17.14 J3.1
  Bottom 0.254: U$11.5 37.86,34.3 R26.2 39.05,32.93 39.05,28.89 41.27,28.89 v49.53,20.64
N$63
  Bottom 0.254: U$11.17 29.14,34.95 R22.2 26.9,8.17 J2.1
N$64  (via drill 0.5)
  Top 0.254: v23.5,38.74 22.86,38.1 22.86,26.99 31.12,18.73 J1.1
  Bottom 0.254: U$11.20 30.03,36.83 27.94,36.83 | 27.94,36.83 R21.2 | 27.94,36.83 26.03,38.74 v23.5,38.74
N$65
  Top 0.254: R16.1 LED9.A
N$66
  Top 0.254: R18.1 LED7.A
N$67
  Top 0.254: R20.1 LED6.A
N$68  (via drill 0.5)
  Top 0.254: v46.67,34.93 46.99,34.61 46.99,29.21 46.41,28.63 U$12.9
  Bottom 0.254: R23.1 42.23,36.6 C17.2 46.44,34.93 v46.67,34.93
N$69  (via drill 0.5)
  Top 0.254: U$12.11 v43.18,31.11
  Bottom 0.254: R26.1 44.04,32.38 44.13,32.38 | 44.13,32.38 C18.2 | v43.18,31.11 44.13,32.07 44.13,32.38
N$70  (via drill 0.5)
  Top 0.254: v24.45,31.11 37.15,31.11 38.1,30.16 U$12.15
  Bottom 0.254: 23.81,32.93 R22.1 | R22.1 23.9,31.66 v24.45,31.11 | C9.2 23.04,33.89 R22.1
N$71  (via drill 0.5)
  Top 0.254: U$12.13 40.64,31.11 40.01,31.75 27.62,31.75 v24.45,34.93
  Bottom 0.254: C8.2 21.68,36.83 R21.1 24.22,35.15 v24.45,34.93
N$73
  Bottom 0.254: J5.3 12.38,8.26 U$1.P8_4
N$77  (via drill 0.5)
  Top 0.254: U$12.4 U$12.3 39.37,22.22 38.1,20.95 38.1,17.46 38.73,16.83 39.28,16.83 R30.2 39.37,16.19 | R17.2 39.37,16.19 | v41.27,15.56 40.01,15.56 39.37,16.19
  Bottom 0.254: U$1.P9_13 65.09,19.05 63.18,19.05 61.91,17.78 43.5,17.78 v41.27,15.56
N$78  (via drill 0.5)
  Top 0.254: U$12.7 U$12.8 45.4,23.12 45.4,18.82 R28.2 46.99,16.19 | 46.99,16.19 R20.2 | v49.53,15.88 47.31,15.88 46.99,16.19
  Bottom 0.254: U$1.P9_11 66.36,15.56 65.41,16.51 50.16,16.51 v49.53,15.88
N$79  (via drill 0.5)
  Top 0.254: U$12.5 U$12.6 | 44.77,17.78 43.9,16.92 R29.2 43.18,16.19 | R18.2 43.18,16.19 | 43.18,16.19 43.81,15.56 v45.09,15.56
  Top 0.406: U$12.6 43.18,22.22 44.77,20.64 44.77,17.78
  Bottom 0.254: v45.09,15.56 46.04,14.61 63.18,14.61 U$1.P9_12
N$80  (via drill 0.5)
  Top 0.254: U$12.2 U$12.1 36.83,21.27 37.15,20.95 37.15,17.46 36.51,16.83 35.65,16.83 R31.2 35.56,16.19 | 35.56,16.19 R16.2 | U$1.P9_15 66.36,20 65.41,19.05 v60.64,19.05 | v37.47,15.56 36.19,15.56 35.56,16.19
  Bottom 0.254: v60.64,19.05 40.96,19.05 v37.47,15.56
VCC  (via drill 0.5, 0.6)
  Top 0.254: v40.32,43.82 37.87,41.36 C7.1 37.47,39.6 v37.47,35.88 v37.47,33.02 | R13.1 51.75,34.29 51.12,34.93 | R12.1 52.07,30.8 51.12,31.75 | U$12.16 36.83,27.3 37.15,26.99 40.01,26.99 | 40.01,26.99 42.23,26.99 | 42.23,26.99 44.77,26.99 | 44.77,26.99 50.8,26.99 51.12,27.3 | U$12.14 39.37,27.62 40.01,26.99 | U$12.12 41.91,27.3 42.23,26.99 | U$12.10 44.45,27.3 44.77,26.99
  Top 0.508: PL1.2 40.96,60.33 | 40.96,60.33 40.96,60.01 | 40.96,60.01 35.88,54.93 | 35.88,54.93 32.21,54.93 Q3.2 | R6.1 31.12,50.17 35.88,54.93 | 40.96,60.01 40.96,47.62 | 40.96,47.62 50.16,38.42 | 50.16,38.42 56.6,38.42 R11.1 | 51.12,27.3 51.12,31.75 51.12,34.93 51.12,37.47 50.16,38.42 | POWER.A v48.58,64.77 | C12.1 40.96,60.33 | v40.32,43.82 40.96,44.45 40.96,47.62 | J5.2 9.93,5.71 C19.1 v10.16,14.61
  Bottom 0.254: U$11.3 37.19,35.6 v37.47,35.88 | U$11.9 37.09,31.7 37.47,32.07 v37.47,33.02
  Bottom 0.508: R10.1 75.88,28.11 Q2.2 71.58,28.75 69.22,31.11 69.22,64.77 67.95,66.04 52.7,66.04 | 47.31,63.08 PL1.2 31.53,63.08 25.72,68.9 8.42,68.9 Q1.2 12.38,61.42 12.38,33.66 5.4,26.67 R9.1 6.76,25.63 10.16,22.22 v10.16,14.61 | 47.31,63.08 49.74,63.08 52.7,66.04 | 52.7,66.04 59.69,73.02 63.67,73.02 Q4.2 | v48.58,64.77 48.58,64.35 47.31,63.08 | R19.2 R24.2 | R24.2 R27.2 38.73,42.46 R25.2 | R24.2 38.96,42.46 v40.32,43.82
VDD_3V3EXP
  Bottom 0.254: U$1.P9_4 U$1.P9_3
VDD_5V
  Bottom 0.254: U$1.P9_6 U$1.P9_5

### Text on the board
tNames: Front | Back | Left | Right | Color | YELLOW | Green | BLUE | RED | Green | BLUE | RED | YELLOW